# Altium project PUA.PrjPcb (part 6 of 14)

## Sheet Public_QSGMII_ETHERNET_POWER.SchDoc
size D
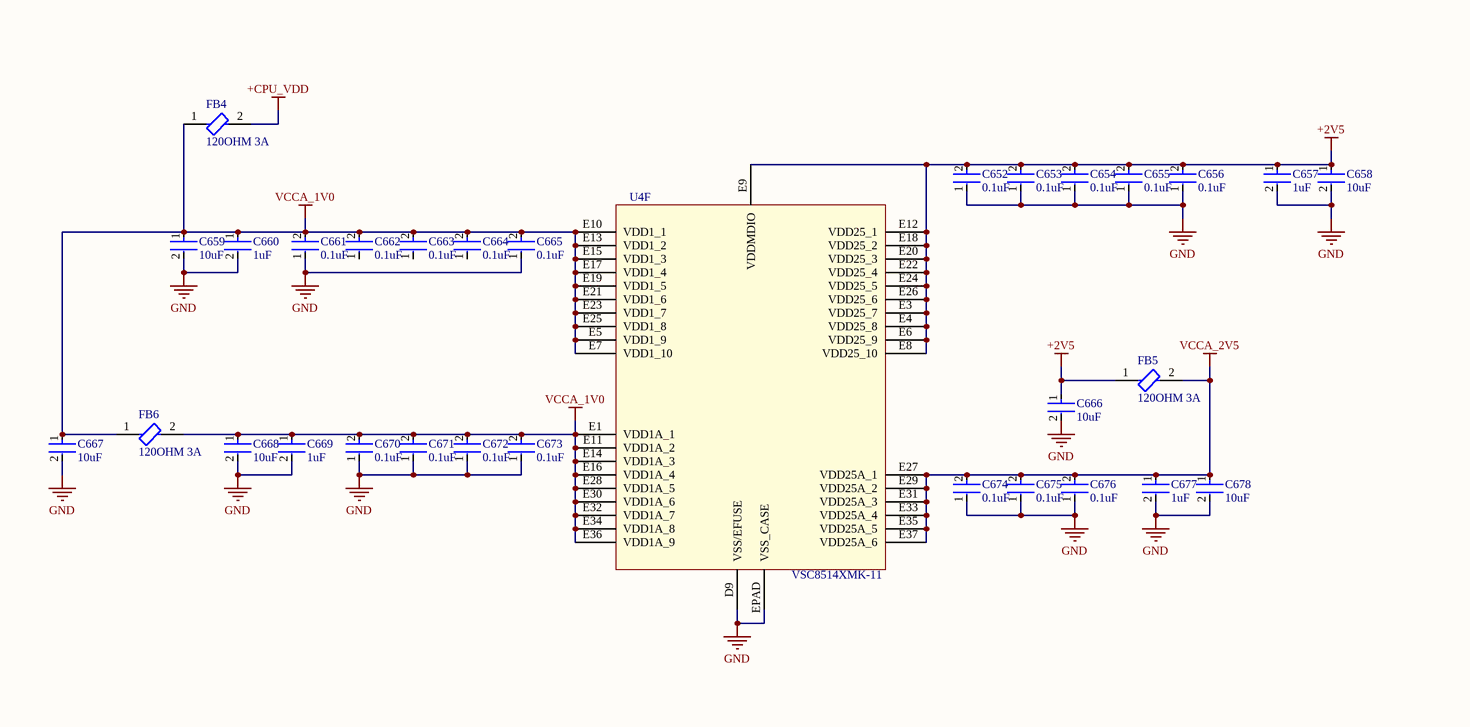
[diagram p26: Public_QSGMII_ETHERNET_POWER.SchDoc, left]
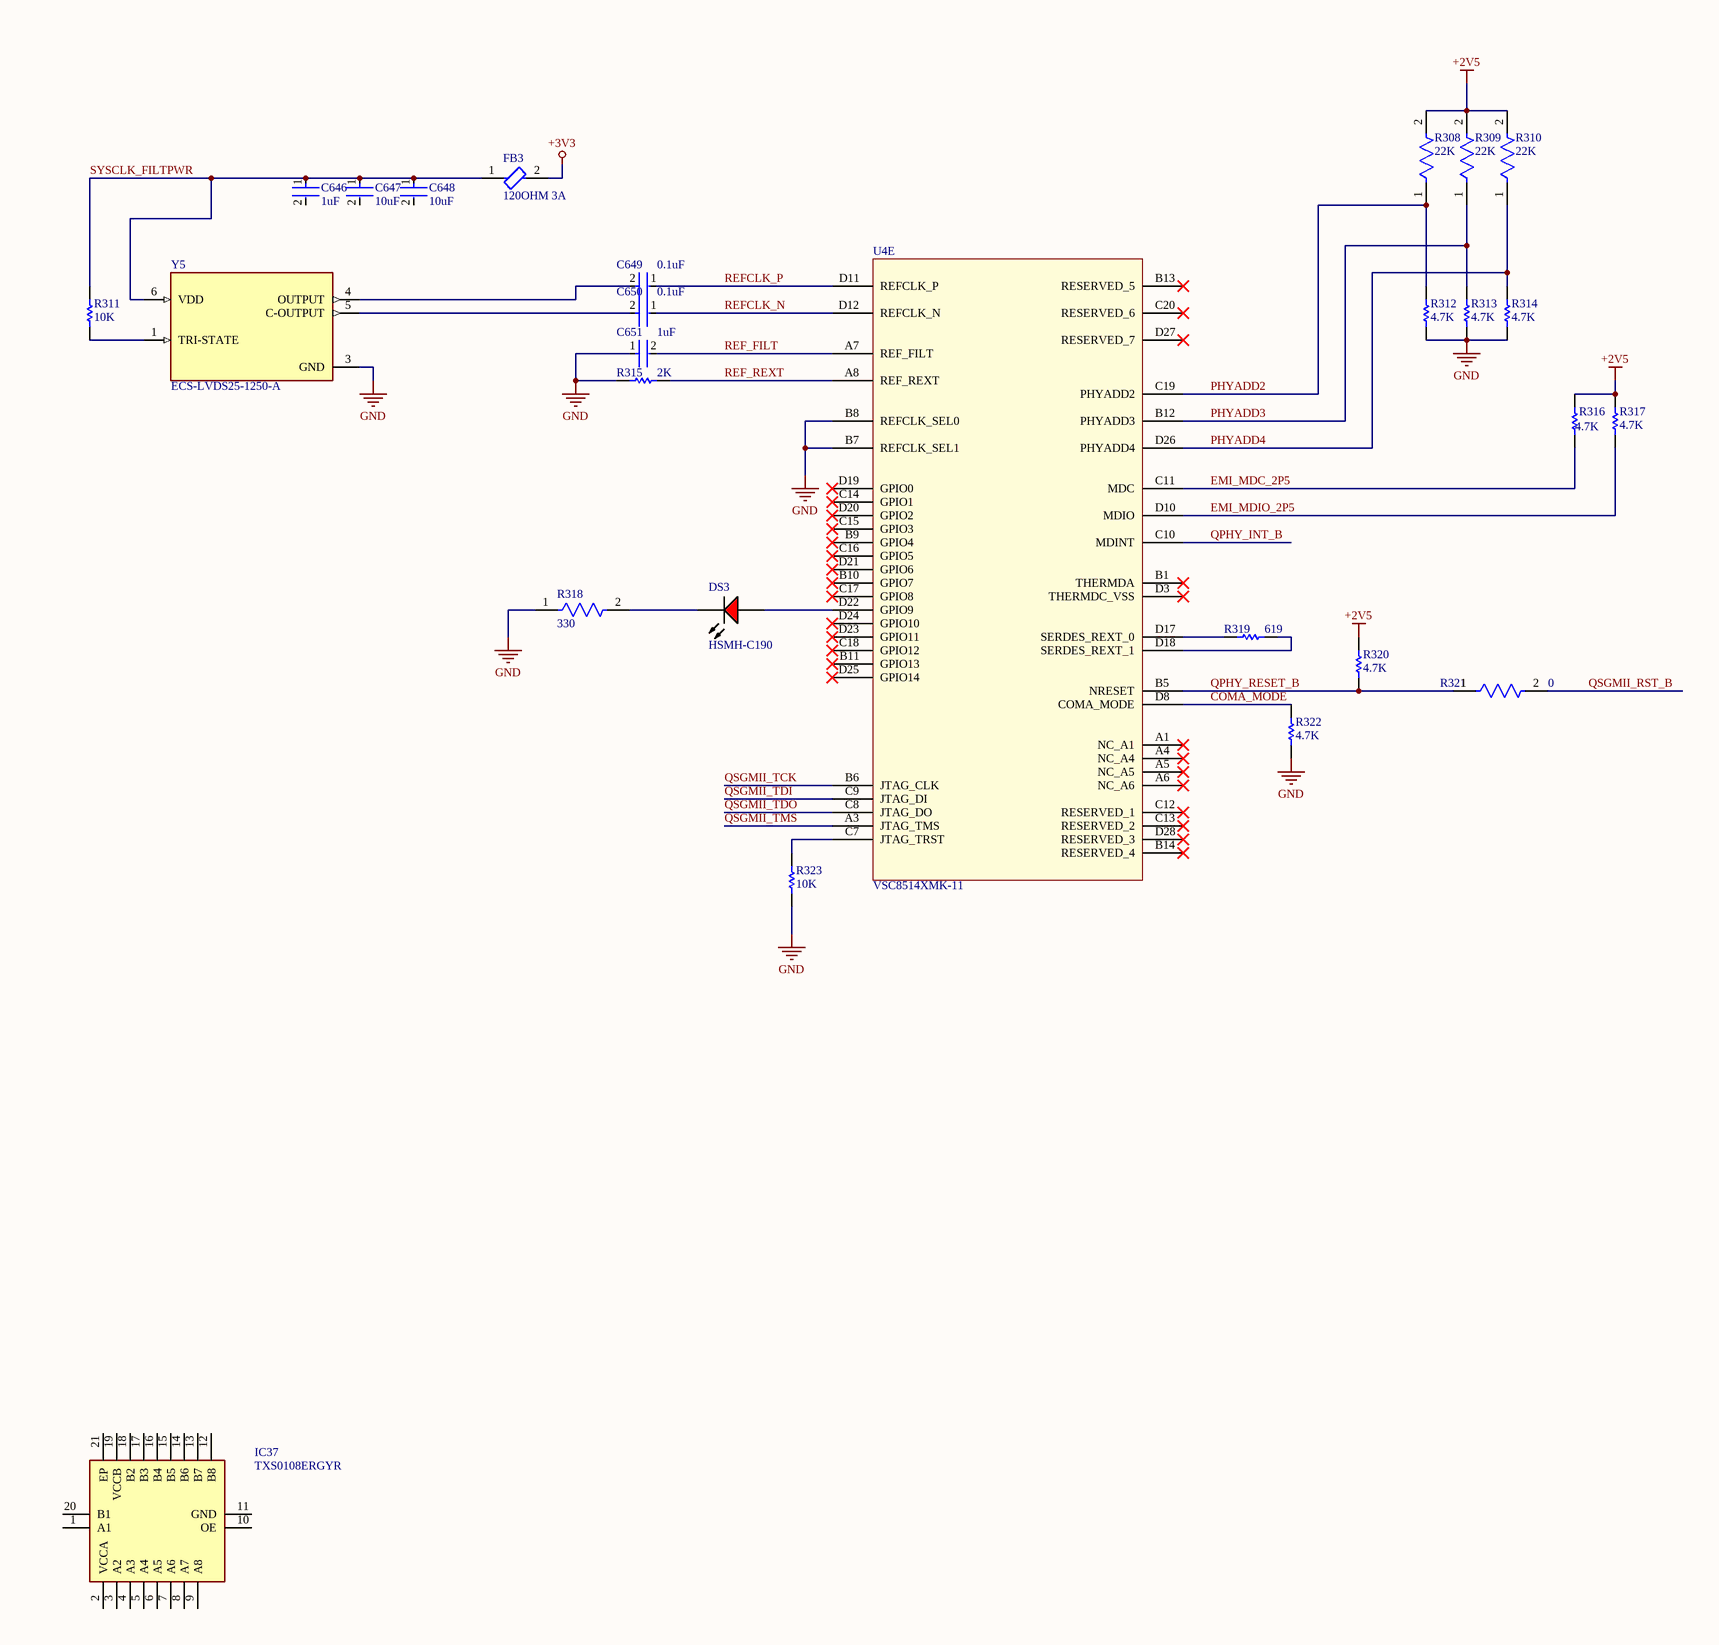
[diagram p27: Public_QSGMII_ETHERNET_POWER.SchDoc, right]

### Parts
C646  1uF  [FP-GRM15-0_1-MFG]
C647  10uF  [FP-C0805C-DG-MFG]
C648  10uF  [FP-C0805C-DG-MFG]
C649  0.1uF  [FP-GRM15-MFG]
C650  0.1uF  [FP-GRM15-MFG]
C651  1uF  [FP-GRM15-0_1-MFG]
C652  0.1uF  [FP-GRM15-MFG]
C653  0.1uF  [FP-GRM15-MFG]
C654  0.1uF  [FP-GRM15-MFG]
C655  0.1uF  [FP-GRM15-MFG]
C656  0.1uF  [FP-GRM15-MFG]
C657  1uF  [FP-GRM15-0_1-MFG]
C658  10uF  [FP-C0805C-DG-MFG]
C659  10uF  [FP-C0805C-DG-MFG]
C660  1uF  [FP-GRM15-0_1-MFG]
C661  0.1uF  [FP-GRM15-MFG]
C662  0.1uF  [FP-GRM15-MFG]
C663  0.1uF  [FP-GRM15-MFG]
C664  0.1uF  [FP-GRM15-MFG]
C665  0.1uF  [FP-GRM15-MFG]
C666  10uF  [FP-C0805C-DG-MFG]
C667  10uF  [FP-C0805C-DG-MFG]
C668  10uF  [FP-C0805C-DG-MFG]
C669  1uF  [FP-GRM15-0_1-MFG]
C670  0.1uF  [FP-GRM15-MFG]
C671  0.1uF  [FP-GRM15-MFG]
C672  0.1uF  [FP-GRM15-MFG]
C673  0.1uF  [FP-GRM15-MFG]
C674  0.1uF  [FP-GRM15-MFG]
C675  0.1uF  [FP-GRM15-MFG]
C676  0.1uF  [FP-GRM15-MFG]
C677  1uF  [FP-GRM15-0_1-MFG]
C678  10uF  [FP-C0805C-DG-MFG]
DS3  HSMH-C190  [AVAG-HSMX-C190_V]
FB3  120OHM 3A  [FP-BLM18-0_15-t0_5-d1_2-MFG]
FB4  120OHM 3A  [FP-BLM18-0_15-t0_5-d1_2-MFG]
FB5  120OHM 3A  [FP-BLM18-0_15-t0_5-d1_2-MFG]
FB6  120OHM 3A  [FP-BLM18-0_15-t0_5-d1_2-MFG]
IC37  TXS0108ERGYR  [SN74LVC541ARGYR]
R308  22K  [FP-ERJ2RK-MFG]
R309  22K  [FP-ERJ2RK-MFG]
R310  22K  [FP-ERJ2RK-MFG]
R311  10K  [RESC1005X40X25LL05T05]
R312  4.7K  [RESC1005X40X25LL05T05]
R313  4.7K  [RESC1005X40X25LL05T05]
R314  4.7K  [RESC1005X40X25LL05T05]
R315  2K  [RESC1005X40X25LL10T10]
R316  4.7K  [RESC1005X40X25LL05T05]
R317  4.7K  [RESC1005X40X25LL05T05]
R318  330  [FP-CRCW0603-e3-MFG]
R319  619  [RESC1005X40X25ML05T05]
R320  4.7K  [RESC1005X40X25LL05T05]
R321  0  [FP-CRCW0402-e3-IPC_C]
R322  4.7K  [RESC1005X40X25LL05T05]
R323  10K  [RESC1005X40X25LL05T05]
U4  VSC8514XMK-11  [QFN138_12X12X0P85_MCH]  (parts E,F of 6)
Y5  ECS-LVDS25-1250-A  [OSC_ECS-LVDS25-1250-A]

### Nets
+2V5: C652.2 C653.2 C654.2 C655.2 C656.2 C657.1 C658.1 C666.1 FB5.1 R308.2 R309.2 R310.2 R316.2 R317.2 R320.2 U4.E3(VDD25_7) U4.E4(VDD25_8) U4.E6(VDD25_9) U4.E8(VDD25_10) U4.E9(VDDMDIO) U4.E12(VDD25_1) U4.E18(VDD25_2) U4.E20(VDD25_3) U4.E22(VDD25_4) U4.E24(VDD25_5) U4.E26(VDD25_6)
+3V3: FB3.2
+CPU_VDD: FB4.2
GND: C651.1 C652.1 C653.1 C654.1 C655.1 C656.1 C657.2 C658.2 C659.2 C660.2 C661.1 C665.1 C666.2 C667.2 C668.2 C669.2 C670.1 C671.1 C672.1 C673.1 C674.1 C675.1 C676.1 C677.2 C678.2 R312.1 R313.1 R314.1 R315.1 R318.1 R322.1 R323.1 U4.B7(REFCLK_SEL1) U4.B8(REFCLK_SEL0) U4.D9(VSS/EFUSE) U4.EPAD(VSS_CASE) Y5.3(GND)
VCCA_1V0: C659.1 C660.1 C661.2 C662.2 C663.2 C664.2 C665.2 C667.1 C668.1 C669.1 C670.2 C671.2 C672.2 C673.2 FB4.1 FB6.1 FB6.2 U4.E1(VDD1A_1) U4.E5(VDD1_9) U4.E7(VDD1_10) U4.E10(VDD1_1) U4.E11(VDD1A_2) U4.E13(VDD1_2) U4.E14(VDD1A_3) U4.E15(VDD1_3) U4.E16(VDD1A_4) U4.E17(VDD1_4) U4.E19(VDD1_5) U4.E21(VDD1_6) U4.E23(VDD1_7) U4.E25(VDD1_8) U4.E28(VDD1A_5) U4.E30(VDD1A_6) U4.E32(VDD1A_7) U4.E34(VDD1A_8) U4.E36(VDD1A_9)
VCCA_2V5: C674.2 C675.2 C676.2 C677.1 C678.1 FB5.2 U4.E27(VDD25A_1) U4.E29(VDD25A_2) U4.E31(VDD25A_3) U4.E33(VDD25A_4) U4.E35(VDD25A_5) U4.E37(VDD25A_6)
COMA_MODE: R322.2 U4.D8(COMA_MODE)
EMI_MDC_2P5: R316.1 U4.C11(MDC)
EMI_MDIO_2P5: R317.1 U4.D10(MDIO)
PHYADD2: R308.1 R312.2 U4.C19(PHYADD2)
PHYADD3: R309.1 R313.2 U4.B12(PHYADD3)
PHYADD4: R310.1 R314.2 U4.D26(PHYADD4)
QPHY_INT_B: U4.C10(MDINT)
QPHY_RESET_B: R320.1 R321.1 U4.B5(NRESET)
QSGMII_RST_B: R321.2
QSGMII_TCK: U4.B6(JTAG_CLK)
QSGMII_TDI: U4.C9(JTAG_DI)
QSGMII_TDO: U4.C8(JTAG_DO)
QSGMII_TMS: U4.A3(JTAG_TMS)
REF_FILT: C651.2 U4.A7(REF_FILT)
REF_REXT: R315.2 U4.A8(REF_REXT)
REFCLK_N: C650.1 U4.D12(REFCLK_N)
REFCLK_P: C649.1 U4.D11(REFCLK_P)
SYSCLK_FILTPWR: C646.1 C647.1 C648.1 FB3.1 R311.2 Y5.6(VDD)
NetC649_2: C649.2 Y5.4(OUTPUT)
NetC650_2: C650.2 Y5.5(C-OUTPUT)
NetDS3_1: DS3.1(A) U4.D22(GPIO9)
NetDS3_2: DS3.2(K) R318.2
NetR311_1: R311.1 Y5.1(TRI-STATE)
NetR319_1: R319.1 U4.D17(SERDES_REXT_0)
NetR319_2: R319.2 U4.D18(SERDES_REXT_1)
NetR323_2: R323.2 U4.C7(JTAG_TRST)

Not connected (* = marked no-connect by the designer): C646 2; C647 2; C648 2; C662 1; C663 1; C664 1; IC37 1(A1) 2(VCCA) 3(A2) 4(A3) 5(A4) 6(A5) 7(A6) 8(A7) 9(A8) 10(OE) 11(GND) 12(B8) 13(B7) 14(B6) 15(B5) 16(B4) 17(B3) 18(B2) 19(VCCB) 20(B1) 21(EP); U4 A1(NC_A1)* A4(NC_A4)* A5(NC_A5)* A6(NC_A6)* B1(THERMDA)* B9(GPIO4)* B10(GPIO7)* B11(GPIO13)* B13(RESERVED_5)* B14(RESERVED_4)* C12(RESERVED_1)* C13(RESERVED_2)* C14(GPIO1)* C15(GPIO3)* C16(GPIO5)* C17(GPIO8)* C18(GPIO12)* C20(RESERVED_6)* D3(THERMDC_VSS)* D19(GPIO0)* D20(GPIO2)* D21(GPIO6)* D23(GPIO11)* D24(GPIO10)* D25(GPIO14)* D27(RESERVED_7)* D28(RESERVED_3)*

### Notes on the sheet
- Title
- Size:
- Date:
- File:
- D
- Number:
- Time:
- Revision:
- Sheet
- of

### Library data of the parts
C646 C651 C657 C660 C669 C677 = CMP-2008-04556-2: as C201-C208 on sheet Public_CPU_DDR4; Octopart: https://octopart.com/grm155r61a105ke15d-murata-197442; Lead Free: Yes; ComponentLink2Description: Datasheet; Temperature: -55°C to +85°C; Temperature Range High: +85°C; Height: 0.55mm; Capacitance: 1uF; Ipc Land Pattern Name: CAPC10050X50; ComponentLink2URL: https://search.murata.co.jp/Ceramy/image/img/A01X/G101/ENG/GRM155R61A105KE15-01A.pdf; Temperature Range Low: -55°C; Device Class L2: Capacitors; Voltage Rating: 10V; RoHS: TRUE; Device Class L1: Passive Components; Device Class L3: Ceramic Capacitors; Temperature Characteristic: X5R; Mouser Description: 0402 1 uF 10 V ±10% Tolerance X5R Surface Mount Multilayer Ceramic Capacitor; Automotive: No; Package: GRM15-0.1; Digikey Description: CAP CER 1UF 10V X5R 0402; Value: 1uF; Category: Cap
C647 C648 C658 C659 C666-C668 C678 = CMP-2007-03243-2: CAP CER 10UF 10V X5R 0805; Manufacturer Part Number: C0805C106K8PACTU; Manufacturer: Kemet; 3DS Part Number: 220-00001; Tolerance: 10%; Temperature Coefficient: 15%; Material: Ceramic; Device Class L2: Capacitors; Device Class L1: Passive Components; ComponentLink2URL: https://content.kemet.com/datasheets/KEM_C1006_X5R_SMD.pdf; Height: 1.4mm; Lead Free: Yes; Digikey Description: CAP CER 10UF 10V X5R 0805; Octopart: https://octopart.com/c0805c106k8pactu-kemet-98697; Capacitance: 10uF; Value: 10uF; Temperature Range Low: -55°C; Temperature: -55°C to +85°C; Automotive: No; Mouser Description: CAP CER 10UF 10V X5R 0805; Ipc Land Pattern Name: CAPC200125X125; Temperature Range High: +85°C; Voltage: 10V; RoHS: TRUE; Device Class L3: Ceramic Capacitors; ComponentLink2Description: Datasheet; Voltage Rating: 10V; Package: C0805C-DG; Temperature Characteristic: X5R; Category: Cap
C649 C650 C652-C656 C661-C665 C670-C676 = CMP-2100-03641-2: as C209 on sheet Public_CPU_DDR4; RoHS: TRUE; Temperature Characteristic: X7R; Octopart: https://octopart.com/grm155r71c104ka88d-murata-196880; Digikey Description: CAP CER 0.1UF 16V X7R 0402; Device Class L3: Ceramic Capacitors; Height: 0.55mm; ComponentLink2Description: Datasheet; Temperature Range Low: -55°C; Ipc Land Pattern Name: CAPC10050X219; ComponentLink2URL: https://search.murata.co.jp/Ceramy/image/img/A01X/G101/ENG/GRM155R71H471KA01-01A.pdf; Device Class L1: Passive Components; Lead Free: yes; Category: Cap; Package: GRM15; Temperature: -55°C to +125°C; Device Class L2: Capacitors; Temperature Range High: +125°C; Mouser Description: 0402 0.1 uF 16V ±10 % Tolerance X7R SMT Multilayer Ceramic Capacitor
DS3 = CMP-1744-00004-1: LED Uni-Color Red, 65 mW, 20 mA, -40 to 85 degC, 2-Pin SMD, RoHS, Tape and Reel; Connector Type: USB; Gender: Male; Current Rating: 1 A; Length: 7.5 mm; Lead Pitch: 0.65 mm; PackageReference: HSMX-C190; Package Quantity: 2000; Max Operating Temperature: 85 degC; PackageDescription: 2-Pin Surface Mount Device, Body 1.6 x 0.8 mm, Height 0.9 mm; ComponentLink3Description: Package Specification; Mount: Surface Mount; Min Operating Temperature: -30 degC; ComponentLink3URL: http://www.fairchildsemi.com/dwg/MA/MA03D.pdf; ComponentLink1Description: Manufacturer URL; Contact Material: Copper; Pins: 5; Width: 5.6 mm; ComponentLink2Description: Datasheet; RoHSCompliant: true; DatasheetVersion: Mar-12; Height: 2.8 mm; Packaging: Tape and Reel; Contact Plating: Gold; ComponentLink1URL: http://www.avagotech.com/; REACH SVHC: No SVHC; ComponentLink2URL: http://docs.avagotech.com/docs/AV02-0551EN
FB3-FB6 = CMP-0686-00602-4: Chip Ferrite Bead, 0603, 120Ω @ 100MHz, 25%, 0.025Ω, 3A; DC Resistance (DCR): 25mR; Shielding: Unshielded; Material: Steel; Number of Circuits: 1; Impedance: 120R; Tolerance: 25%; REACH SVHC: No SVHC; Case/Package: 0603; Max DC Current: 3A; Core Material: Ferrite; Case Code (Metric): 1608; Frequency: 100MHz; Package Quantity: 1; Height: 0.8mm; Lead Free: Lead Free; Test Frequency: 100MHz; RoHS Compliant: Yes; DC Resistance-Max: 25mR; Min Operating Temperature: -55°C; Width: 0.8mm; Termination: SMD/SMT; Length: 1.6mm; Max Current Rating: 3A; Number of Lines: 1; Series: BLM18S; Number of Pins: 2; Packaging: Tape and Reel; Current Rating: 3A; Depth: 0.8mm; Case Code (Imperial): 0603; Max Operating Temperature: 125°C
IC37 = TXS0108ERGYR: Integrated Circuit; Manufacturer_Name: Texas Instruments; Datasheet Link: http://www.ti.com/lit/gpn/txs0108e; Height: 1mm; Manufacturer_Part_Number: TXS0108ERGYR; Mouser Part Number: 595-TXS0108ERGYR; Mouser Price/Stock: https://www.mouser.co.uk/ProductDetail/Texas-Instruments/TXS0108ERGYR/?qs=dqESbKqT1jau1kZv8JPj9Q%3D%3D; Arrow Part Number: TXS0108ERGYR; Arrow Price/Stock: https://www.arrow.com/en/products/txs0108ergyr/texas-instruments
R308-R310 = CMP-2002-01133-2: RES SMD 22K OHM 1% 1/10W 0402; Resistance: 22kR; Max Power Dissipation: 100mW; Voltage Rating (DC): 50V; Temperature Coefficient: 100ppm/°C; Case Code (Imperial): 0402; Military Standard: Not; Case Code (Metric): 1005; Termination: SMD/SMT; Tolerance: 1%; Width: 0.02inch; Number of Terminations: 2; Packaging: Tape and Reel; Voltage Rating: 50V; Radiation Hardening: No; REACH SVHC: No SVHC; Contact Plating: Tin; Lead Free: Lead Free; Case/Package: 0402; Power Rating: 100mW; Depth: 0.5mm; Length: 1mm; Number of Pins: 2; Max Operating Temperature: 155°C; Composition: Thick Film; Height: 0.35mm; Min Operating Temperature: -55°C; Mount: Surface Mount; Package Quantity: 10000
R311 R323 = CMP-2000-07588-1: as R271-R274 on sheet Public_CPU_Sub_Power_Supplies; RoHSCompliant: True; Lead Free: LeadFree; Package Quantity: 1; Contact Plating: Tin; Length: 1mm; Radiation Hardening: No; REACH SVHC: NoSVHC; Max Operating Temperature: 155degC; Depth: 0.5mm; Case Code (Imperial): 0402; Military Standard: Not; Package Description: 2-Pin Surface Mount Device, Body 1 x 0.5 mm; Termination: SMD/SMT; Case Code (Metric): 1005; Height: 0.35mm; Packaging: TapeandReel; Voltage Rating (DC): 50V; Package Reference: 402; Number of Pins: 2; Tolerance: 1%; Mounting Technology: SurfaceMount; Width: 0.02inch; Mount: SurfaceMount; Datasheet URL: https://industrial.panasonic.com/cdbs/www-data/pdf/RDA0000/AOA0000C304.pdf; Composition: ThickFilm; Datasheet Version: 02/2017; Manufacturer URL: http://www.panasonic.com/; Max Power Dissipation: 100mW; Number of Terminations: 2; Min Operating Temperature: -55degC
R312-R314 R316 R317 R320 R322 = CMP-2002-01154-4: as R144 on sheet Public_CPU_DDR4; Height: 0.35 mm; Mounting Technology: Surface Mount; REACH SVHC: Yes; Resistance: 4.7 KOhm; Max Operating Temperature: 155 degC; ComponentLink1Description: Manufacturer URL; ComponentLink2Description: Datasheet; Pins: 2; PackageReference: 0402; Tolerance: 1%; Case Code (Imperial): 0402; Length: 1 mm; PackageDescription: 2-Pin Surface Mount Device, Body 1 x 0.5 mm; RoHSCompliant: true; Package Quantity: 1; Radiation Hardening: No; DatasheetVersion: 04/2015; Width: 0.5 mm; Case Code (Metric): 1005; Mount: Surface Mount; ComponentLink1URL: http://www.panasonic.com/; Min Operating Temperature: -55 degC; Packaging: Cut Tape; ComponentLink2URL: http://industrial.panasonic.com/cdbs/www-data/pdf/RDA0000/AOA0000C86.pdf
R315 = CMP-2002-05790-1: Manufacturer: Panasonic; Part Number: ERA-2AEB202X
R318 = CMP-1012-00454-3: RES Thick Film, 330Ω, 1%, 0.1W, 100ppm/°C, 0603; Voltage Rating: 75V; Max Power Dissipation: 100mW; Resistance: 330R; Depth: 0.85mm; Contact Plating: Tin; Package Quantity: 10; Termination: SMD/SMT; Tolerance: 1%; Height: 0.45mm; Number of Terminations: 2; Radiation Hardening: No; Features: Automotive AEC-Q200; Case/Package: 0603; Mount: Surface Mount; Case Code (Metric): 1608; Lead Free: Lead Free; Temperature Coefficient: 100ppm/°C; Weight: 7.1E-05oz; Military Standard: Not; Packaging: Tape and Reel; Max Operating Temperature: 155°C; Voltage Rating (DC): 75V; Length: 1.55mm; Min Operating Temperature: -55°C; Composition: Thick Film; Case Code (Imperial): 0603; Width: 0.033inch; Power Rating: 100mW
R319 = CMP-2002-01017-1: Part Number: ERJ-2RKF6193X; Manufacturer: Panasonic
R321 = CMP-2002-08122-2: as R142 on sheet Public_CPU_DDR4; Contact Plating: Tin; Height: 0.35mm; Radiation Hardening: No; Features: Automotive AEC-Q200; Composition: Thick Film; Width: 0.5mm; Weight: 2.3E-05oz; Termination: SMD/SMT; Packaging: Tape and Reel; Mount: Surface Mount; Case Code (Metric): 1005; Military Standard: Not; Min Operating Temperature: -55°C; Number of Terminations: 2; Package Quantity: 1; Case Code (Imperial): 0402; Depth: 0.5mm; Max Operating Temperature: 155°C; Case/Package: 0402; Power Rating: 63mW; Lead Free: Lead Free; Voltage Rating (DC): 50V; Length: 1mm
U4 = VSC8514XMK-11: No Description Available; pin to pad: C24>none; SourceLibrary: Microchip_2020-10-14; Built_By: EMA_Cory; Vendor: Microchip; Datasheet: https://ww1.microchip.com/downloads/en/DeviceDoc/VMDS-10446.pdf; Copyright: Copyright (C) 2018 Accelerated Designs. All rights reserved; Manufacturer_Part_Number: VSC8514XMK-11; RefDes: RefDes; Type: DEV
Y5 = ECS-LVDS25-1250-A: Low Voltage Differential Signaling SMD LVDS oscillators.; MF: {'manufacturer': u'ECS Inc.'}; Availability: Unavailable; MP: ECS-LVDS25-1250-A; Value: *; Price: None; Package: None